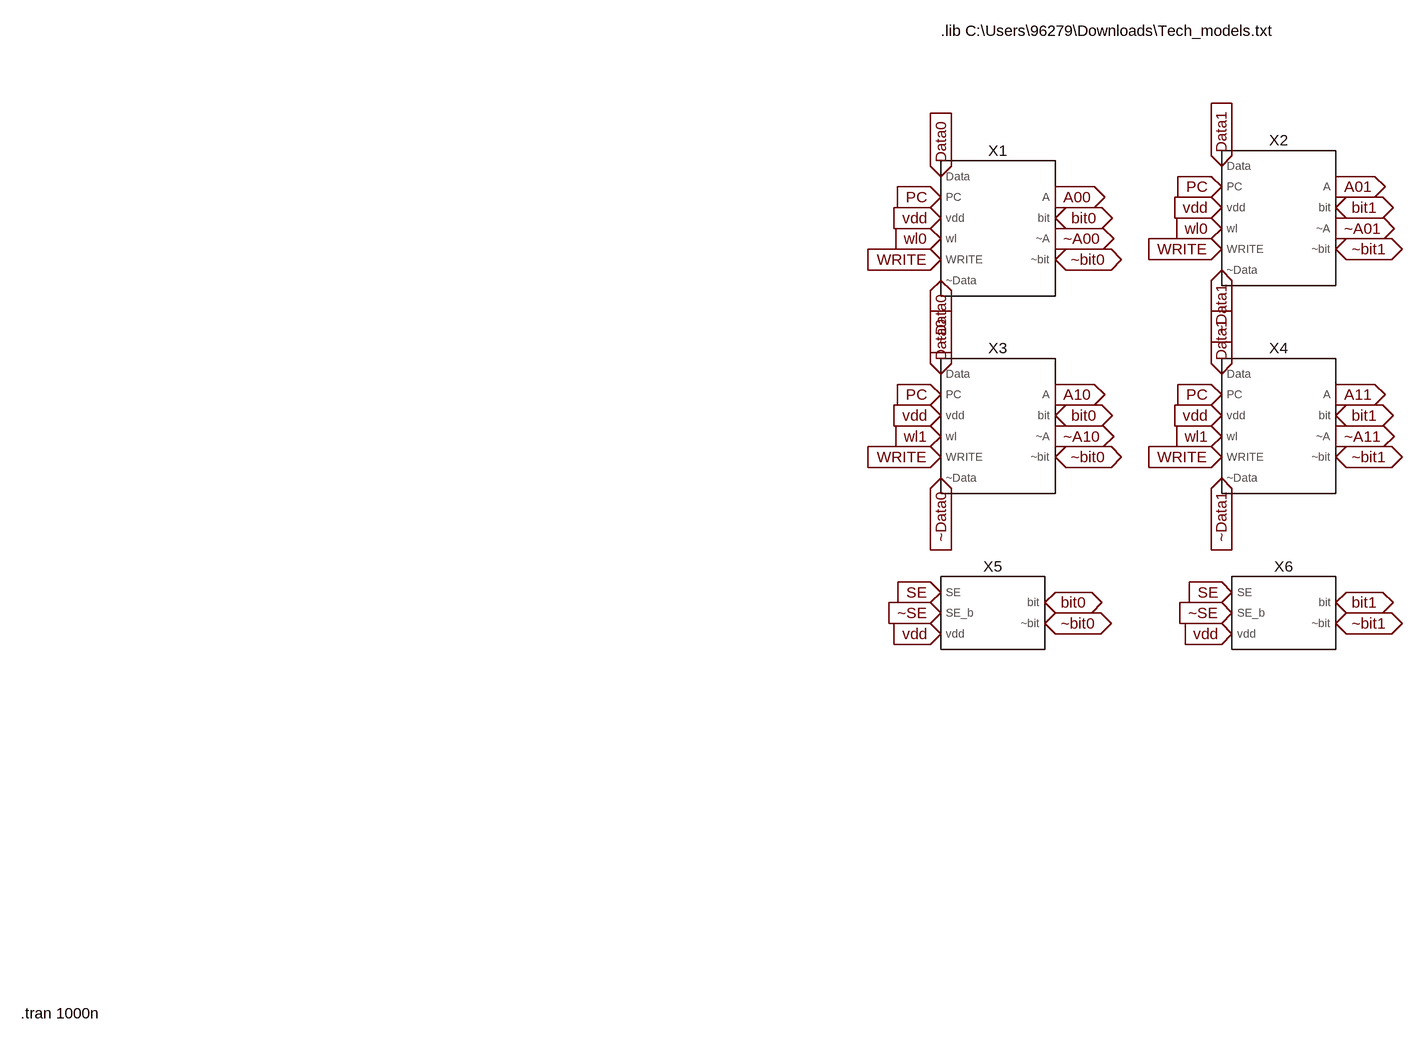
[diagram p0: schematic 2x2Sram.asc]
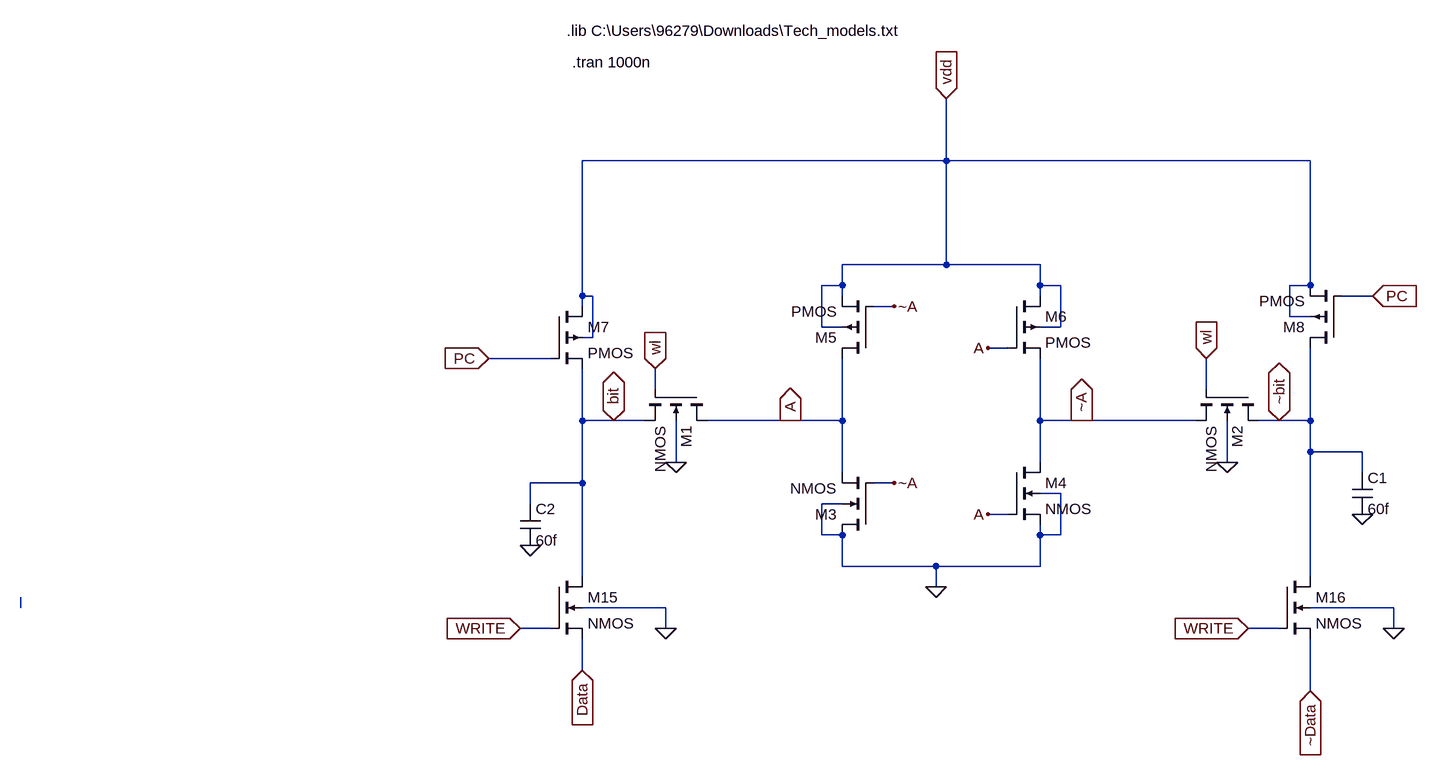
[diagram p1: sub-circuit sram_cell.asc]
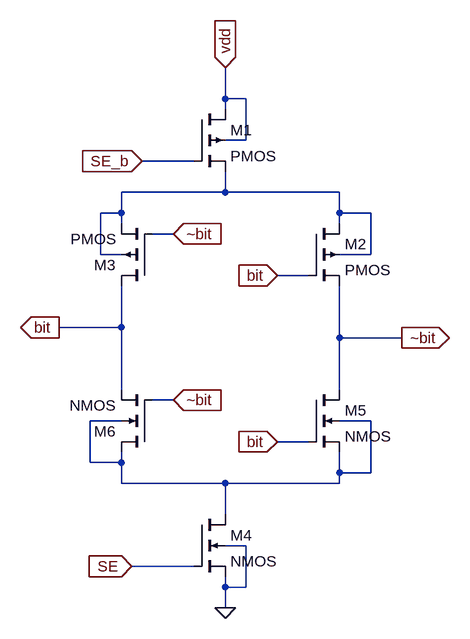
[diagram p2: sub-circuit se.asc]
2x2Sram.asc, the LTspice schematic file:
Version 4
SHEET 1 2912 1304
FLAG 32 96 wl0
IOPIN 32 96 In
FLAG 464 80 wl0
IOPIN 464 80 In
FLAG 32 400 wl1
IOPIN 32 400 In
FLAG 464 400 wl1
IOPIN 464 400 In
FLAG 464 112 WRITE
IOPIN 464 112 In
FLAG 32 128 WRITE
IOPIN 32 128 In
FLAG 32 432 WRITE
IOPIN 32 432 In
FLAG 464 432 WRITE
IOPIN 464 432 In
FLAG 32 0 Data0
IOPIN 32 0 In
FLAG 32 304 Data0
IOPIN 32 304 In
FLAG 464 -16 Data1
IOPIN 464 -16 In
FLAG 464 304 Data1
IOPIN 464 304 In
FLAG 464 16 PC
IOPIN 464 16 In
FLAG 32 32 PC
IOPIN 32 32 In
FLAG 464 336 PC
IOPIN 464 336 In
FLAG 32 336 PC
IOPIN 32 336 In
FLAG 464 464 ~Data1
IOPIN 464 464 In
FLAG 32 464 ~Data0
IOPIN 32 464 In
FLAG 464 144 ~Data1
IOPIN 464 144 In
FLAG 32 160 ~Data0
IOPIN 32 160 In
FLAG 464 48 vdd
IOPIN 464 48 In
FLAG 32 368 vdd
IOPIN 32 368 In
FLAG 464 368 vdd
IOPIN 464 368 In
FLAG 32 64 vdd
IOPIN 32 64 In
FLAG 208 32 A00
IOPIN 208 32 Out
FLAG 640 16 A01
IOPIN 640 16 Out
FLAG 640 336 A11
IOPIN 640 336 Out
FLAG 640 400 ~A11
IOPIN 640 400 Out
FLAG 640 80 ~A01
IOPIN 640 80 Out
FLAG 208 96 ~A00
IOPIN 208 96 Out
FLAG 208 336 A10
IOPIN 208 336 Out
FLAG 208 400 ~A10
IOPIN 208 400 Out
FLAG 32 672 ~SE
IOPIN 32 672 In
FLAG 32 640 SE
IOPIN 32 640 In
FLAG 32 704 vdd
IOPIN 32 704 In
FLAG 480 672 ~SE
IOPIN 480 672 In
FLAG 480 640 SE
IOPIN 480 640 In
FLAG 480 704 vdd
IOPIN 480 704 In
FLAG 208 368 bit0
IOPIN 208 368 BiDir
FLAG 192 656 bit0
IOPIN 192 656 BiDir
FLAG 640 368 bit1
IOPIN 640 368 BiDir
FLAG 640 656 bit1
IOPIN 640 656 BiDir
FLAG 208 432 ~bit0
IOPIN 208 432 BiDir
FLAG 192 688 ~bit0
IOPIN 192 688 BiDir
FLAG 640 688 ~bit1
IOPIN 640 688 BiDir
FLAG 640 432 ~bit1
IOPIN 640 432 BiDir
FLAG 208 64 bit0
IOPIN 208 64 BiDir
FLAG 640 48 bit1
IOPIN 640 48 BiDir
FLAG 208 128 ~bit0
IOPIN 208 128 BiDir
FLAG 640 112 ~bit1
IOPIN 640 112 BiDir
SYMBOL SRAM_cell 112 80 R0
SYMATTR InstName X1
SYMBOL SRAM_cell 544 64 R0
SYMATTR InstName X2
SYMBOL SRAM_cell 112 384 R0
SYMATTR InstName X3
SYMBOL SRAM_cell 544 384 R0
SYMATTR InstName X4
SYMBOL se 112 672 R0
SYMATTR InstName X5
SYMBOL se 560 672 R0
SYMATTR InstName X6
TEXT -1384 1288 Left 2 !.tran 1000n
TEXT 32 -224 Left 2 !.lib C:\\Users\\96279\\Downloads\\Tech_models.txt

sram_cell.asc, the sub-circuit schematic file:
Version 4
SHEET 1 3236 1572
WIRE 1520 112 1520 16
WIRE 1520 112 960 112
WIRE 2080 112 1520 112
WIRE 1520 272 1520 112
WIRE 1520 272 1360 272
WIRE 1664 272 1520 272
WIRE 1360 304 1360 272
WIRE 1360 304 1328 304
WIRE 1664 304 1664 272
WIRE 1696 304 1664 304
WIRE 2080 304 2080 112
WIRE 2080 304 2048 304
WIRE 960 320 960 112
WIRE 976 320 960 320
WIRE 1360 320 1360 304
WIRE 1664 320 1664 304
WIRE 2176 320 2128 320
WIRE 960 336 960 320
WIRE 1440 336 1408 336
WIRE 2048 352 2048 304
WIRE 2080 352 2048 352
WIRE 1328 368 1328 304
WIRE 1360 368 1328 368
WIRE 1696 368 1696 304
WIRE 1696 368 1664 368
WIRE 976 384 976 320
WIRE 976 384 960 384
WIRE 1616 400 1584 400
WIRE 912 416 816 416
WIRE 1072 464 1072 432
WIRE 1920 464 1920 416
WIRE 960 512 960 432
WIRE 1008 512 960 512
WIRE 1056 512 1008 512
WIRE 1280 512 1152 512
WIRE 1360 512 1360 416
WIRE 1360 512 1280 512
WIRE 1664 512 1664 416
WIRE 1728 512 1664 512
WIRE 1904 512 1728 512
WIRE 2032 512 2000 512
WIRE 2080 512 2080 400
WIRE 2080 512 2032 512
WIRE 2080 560 2080 512
WIRE 2160 560 2080 560
WIRE 1104 576 1104 512
WIRE 1664 576 1664 512
WIRE 1952 576 1952 512
WIRE 1360 592 1360 512
WIRE 2160 592 2160 560
WIRE 960 608 960 512
WIRE 960 608 880 608
WIRE 1440 608 1408 608
WIRE 1696 624 1664 624
WIRE 880 640 880 608
WIRE 1360 640 1328 640
WIRE 1616 656 1584 656
WIRE 1328 688 1328 640
WIRE 1360 688 1328 688
WIRE 1664 688 1664 672
WIRE 1696 688 1696 624
WIRE 1696 688 1664 688
WIRE 1360 736 1360 688
WIRE 1504 736 1360 736
WIRE 1664 736 1664 688
WIRE 1664 736 1504 736
WIRE 960 752 960 608
WIRE 2080 752 2080 560
WIRE 1504 768 1504 736
WIRE 96 800 96 784
WIRE 1088 800 960 800
WIRE 2208 800 2080 800
WIRE 912 832 864 832
WIRE 1088 832 1088 800
WIRE 2032 832 1984 832
WIRE 2208 832 2208 800
WIRE 960 896 960 848
WIRE 2080 928 2080 848
FLAG 1728 512 ~A
IOPIN 1728 512 Out
FLAG 1280 512 A
IOPIN 1280 512 Out
FLAG 1584 400 A
FLAG 1584 656 A
FLAG 1440 608 ~A
FLAG 1440 336 ~A
FLAG 1072 432 wl
IOPIN 1072 432 In
FLAG 1920 416 wl
IOPIN 1920 416 In
FLAG 816 416 PC
IOPIN 816 416 In
FLAG 1008 512 bit
IOPIN 1008 512 BiDir
FLAG 1952 576 0
FLAG 2176 320 PC
IOPIN 2176 320 In
FLAG 1104 576 0
FLAG 2032 512 ~bit
IOPIN 2032 512 BiDir
FLAG 864 832 WRITE
IOPIN 864 832 In
FLAG 960 896 Data
IOPIN 960 896 In
FLAG 1088 832 0
FLAG 1984 832 WRITE
IOPIN 1984 832 In
FLAG 2080 928 ~Data
IOPIN 2080 928 In
FLAG 2208 832 0
FLAG 880 704 0
FLAG 2160 656 0
FLAG 1504 768 0
FLAG 1520 16 vdd
IOPIN 1520 16 In
SYMBOL nmos4 1152 464 R90
SYMATTR InstName M1
SYMATTR Value2 l=250n w=100n
SYMBOL nmos4 2000 464 R90
SYMATTR InstName M2
SYMATTR Value2 l=250n w=100n
SYMBOL nmos4 1408 688 R180
SYMATTR InstName M3
SYMATTR Value2 l=32n w=64n
SYMBOL nmos4 1616 576 R0
SYMATTR InstName M4
SYMATTR Value2 l=32n w=64n
SYMBOL pmos4 1408 416 R180
SYMATTR InstName M5
SYMATTR Value2 l=250n w=600n
SYMBOL pmos4 1616 320 R0
SYMATTR InstName M6
SYMATTR Value2 l=250n w=600n
SYMBOL pmos4 912 336 R0
SYMATTR InstName M7
SYMATTR Value2 l=32n w=1280n
SYMBOL pmos4 2128 400 R180
SYMATTR InstName M8
SYMATTR Value2 l=32n w=1280n
SYMBOL nmos4 912 752 R0
SYMATTR InstName M15
SYMATTR Value2 l=32n w=1000n
SYMBOL nmos4 2032 752 R0
SYMATTR InstName M16
SYMATTR Value2 l=32n w=1000n
SYMBOL cap 2144 592 R0
SYMATTR InstName C1
SYMATTR Value 60f
SYMBOL cap 864 640 R0
SYMATTR InstName C2
SYMATTR Value 60f
TEXT 936 -88 Left 2 !.lib C:\\Users\\96279\\Downloads\\Tech_models.txt
TEXT 944 -40 Left 2 !.tran 1000n

se.asc, the sub-circuit schematic file:
Version 4
SHEET 1 880 868
WIRE 208 64 208 16
WIRE 240 64 208 64
WIRE 208 80 208 64
WIRE 240 128 240 64
WIRE 240 128 208 128
WIRE 160 160 80 160
WIRE 208 208 208 176
WIRE 208 208 48 208
WIRE 384 208 208 208
WIRE 48 240 48 208
WIRE 48 240 16 240
WIRE 384 240 384 208
WIRE 432 240 384 240
WIRE 48 256 48 240
WIRE 384 256 384 240
WIRE 128 272 96 272
WIRE 16 304 16 240
WIRE 48 304 16 304
WIRE 432 304 432 240
WIRE 432 304 384 304
WIRE 336 336 288 336
WIRE 48 416 48 352
WIRE 48 416 -48 416
WIRE 384 432 384 352
WIRE 480 432 384 432
WIRE 48 512 48 416
WIRE 384 512 384 432
WIRE 128 528 96 528
WIRE 48 560 0 560
WIRE 432 560 384 560
WIRE 336 592 288 592
WIRE 0 624 0 560
WIRE 48 624 48 608
WIRE 48 624 0 624
WIRE 384 640 384 608
WIRE 432 640 432 560
WIRE 432 640 384 640
WIRE 48 656 48 624
WIRE 208 656 48 656
WIRE 384 656 384 640
WIRE 384 656 208 656
WIRE 208 704 208 656
WIRE 240 752 208 752
WIRE 160 784 64 784
WIRE 208 816 208 800
WIRE 240 816 240 752
WIRE 240 816 208 816
WIRE 208 848 208 816
FLAG 208 16 vdd
IOPIN 208 16 In
FLAG 80 160 SE_b
IOPIN 80 160 In
FLAG 288 336 bit
IOPIN 288 336 In
FLAG 288 592 bit
IOPIN 288 592 In
FLAG 128 272 ~bit
IOPIN 128 272 In
FLAG 128 528 ~bit
IOPIN 128 528 In
FLAG -48 416 bit
IOPIN -48 416 Out
FLAG 480 432 ~bit
IOPIN 480 432 Out
FLAG 208 848 0
FLAG 64 784 SE
IOPIN 64 784 In
SYMBOL pmos4 160 80 R0
SYMATTR InstName M1
SYMATTR Value2 l=32n w=640n
SYMBOL pmos4 336 256 R0
SYMATTR InstName M2
SYMATTR Value2 l=32n w=64n
SYMBOL pmos4 96 352 R180
SYMATTR InstName M3
SYMATTR Value2 l=32n w=64n
SYMBOL nmos4 160 704 R0
SYMATTR InstName M4
SYMATTR Value2 l=32n w=640n
SYMBOL nmos4 336 512 R0
SYMATTR InstName M5
SYMATTR Value2 l=32n w=640n
SYMBOL nmos4 96 608 R180
SYMATTR InstName M6
SYMATTR Value2 l=32n w=640n

The netlist it stands for:
* 2x2Sram.asc
XX1 Data0 PC vdd wl0 WRITE ~Data0 A00 bit0 ~A00 ~bit0 sram_cell
XX2 Data1 PC vdd wl0 WRITE ~Data1 A01 bit1 ~A01 ~bit1 sram_cell
XX3 Data0 PC vdd wl1 WRITE ~Data0 A10 bit0 ~A10 ~bit0 sram_cell
XX4 Data1 PC vdd wl1 WRITE ~Data1 A11 bit1 ~A11 ~bit1 sram_cell
XX5 SE ~SE vdd bit0 ~bit0 se
XX6 SE ~SE vdd bit1 ~bit1 se

* block symbol definitions
.subckt sram_cell Data PC vdd wl WRITE ~Data A bit ~A ~bit
M1 A wl bit 0 NMOS l=250n w=100n
M2 ~bit wl ~A 0 NMOS l=250n w=100n
M3 0 ~A A 0 NMOS l=32n w=64n
M4 ~A A 0 0 NMOS l=32n w=64n
M5 A ~A vdd vdd PMOS l=250n w=600n
M6 vdd A ~A vdd PMOS l=250n w=600n
M7 vdd PC bit vdd PMOS l=32n w=1280n
M8 ~bit PC vdd vdd PMOS l=32n w=1280n
M15 bit WRITE Data 0 NMOS l=32n w=1000n
M16 ~bit WRITE ~Data 0 NMOS l=32n w=1000n
C1 ~bit 0 60f
C2 bit 0 60f
.lib C:\Users\96279\Downloads\Tech_models.txt
.tran 1000n
.ends sram_cell

.subckt se SE SE_b vdd bit ~bit
M1 vdd SE_b N001 vdd PMOS l=32n w=640n
M2 N001 bit ~bit N001 PMOS l=32n w=64n
M3 bit ~bit N001 N001 PMOS l=32n w=64n
M4 N002 SE 0 0 NMOS l=32n w=640n
M5 ~bit bit N002 N002 NMOS l=32n w=640n
M6 N002 ~bit bit N002 NMOS l=32n w=640n
.ends se

.model NMOS NMOS
.model PMOS PMOS
.lib standard.mos
.tran 1000n
.lib C:\Users\96279\Downloads\Tech_models.txt
.backanno
.end